# Altium schematic sheet Power.SchDoc
size A4
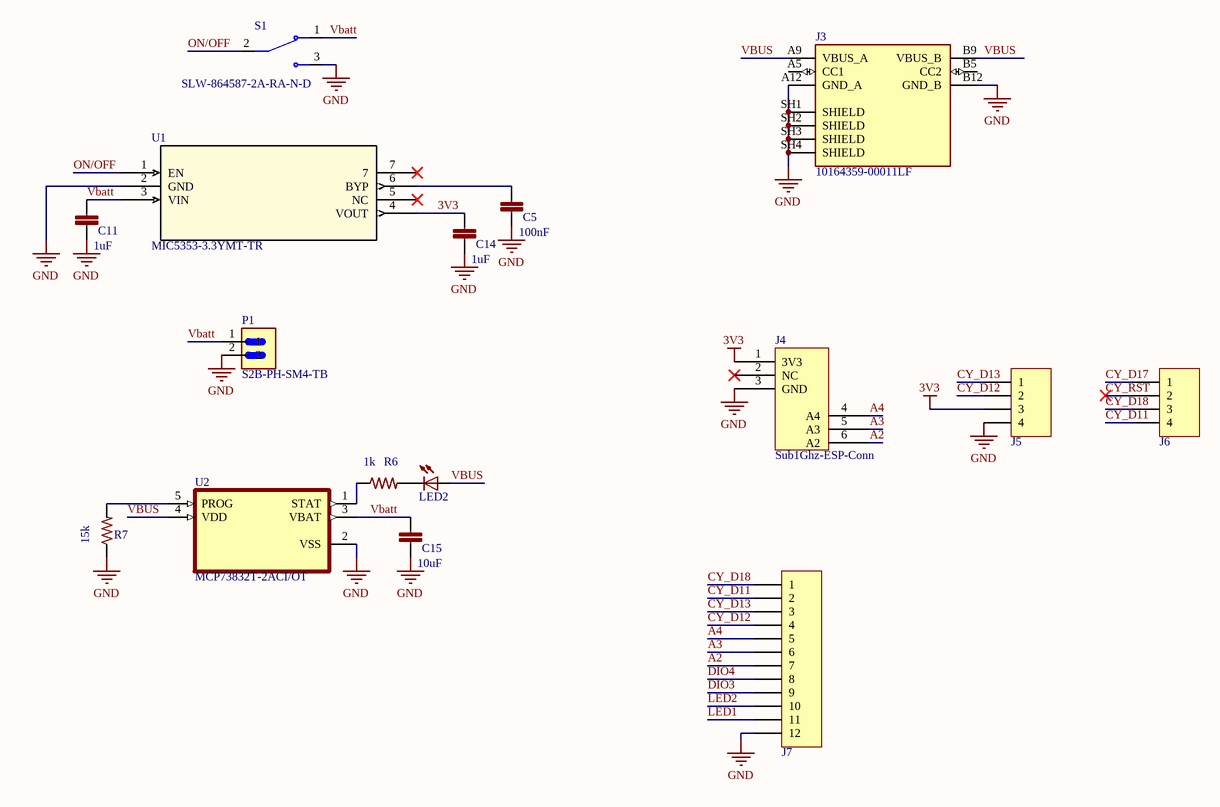
[diagram p0: Power.SchDoc]

## Parts
C5  100nF  [C0402 - rounded]
C11  1uF  [C0402 - rounded]
C14  1uF  [C0402 - rounded]
C15  10uF  [C0603 - rounded]
J3  10164359-00011LF  [AMPHENOL_10164359-00011LF]
J4  Sub1Ghz-ESP-Conn  [Sub1GHz-ESP-Conn]
J5  04p  [61300411121]  (value not drawn)
J6  04p  [61300411121]  (value not drawn)
J7  12p  [61301211821]  (value not drawn)
LED2  LEDCHIPLED_1206  [CHIPLED_1206]  (value not drawn)
P1  S2B-PH-SM4-TB  [JST_S2B-PH-SM4-TB]
R6  1k  [R0603 - rounded]
R7  15k  [R0603 - rounded]
S1  SLW-864587-2A-RA-N-D  [SW_SLW-864587-2A-RA-N-D]
U1  MIC5353-3.3YMT-TR  [MLF-6_MT_MCH-M]
U2  MCP73832T-2ACI/OT  [SOT95P270X145-5N]

## Nets
3V3: C14.1 J4.1(3V3) J5.3 U1.4(VOUT)
GND: C5.2 C11.2 C14.2 C15.2 J3.A12(GND_A) J3.B12(GND_B) J3.SH1(SHIELD) J3.SH2(SHIELD) J3.SH3(SHIELD) J3.SH4(SHIELD) J4.3(GND) J5.4 J7.12 P1.2 R7.1 S1.3 U1.2(GND) U2.2(VSS)
A2: J4.6(A2) J7.7
A3: J4.5(A3) J7.6
A4: J4.4(A4) J7.5
CY_D11: J6.4 J7.2
CY_D12: J5.2 J7.4
CY_D13: J5.1 J7.3
CY_D17: J6.1
CY_D18: J6.3 J7.1
CY_RST: J6.2
DIO3: J7.9
DIO4: J7.8
LED1: J7.11
LED2: J7.10
ON/OFF: S1.2 U1.1(EN)
Vbatt: C11.1 C15.1 P1.1 S1.1 U1.3(VIN) U2.3(VBAT)
VBUS: J3.A9(VBUS_A) J3.B9(VBUS_B) LED2.A U2.4(VDD)
NetC5_1: C5.1 U1.6(BYP)
NetLED2_C: LED2.C R6.2
NetR6_1: R6.1 U2.1(STAT)
NetR7_2: R7.2 U2.5(PROG)

Not connected (* = marked no-connect by the designer): J3 A5(CC1) B5(CC2); J4 2(NC)*; U1 5(NC)* 7*

## Library data of the parts
C5 C11 C14 C15 = C-EU-SMD: Generic Capacitor SMD
  C5: Value: 100nF
  C11 C14: Value: 1uF
  C15: Value: 10uF
J3 = 10164359-00011LF: USB Type C Receptacle SMT Single Row 6Pin; MF: Amphenol; MP: 1016435900011LF; SnapEDA_Link: https://www.snapeda.com/parts/1016435900011LF/Amphenol/view-part/?ref=snap; Package: None; Value: *; Check_prices: https://www.snapeda.com/parts/1016435900011LF/Amphenol/view-part/?ref=eda
J5 J6 = 61300411121: WR-PHD 2.54 mm THT Pin Header, 04p; Vendor: Wurth Elektronik; Part Number: 61300411121; Value: 04p
J7 = 61301211821: WR-PHD 2.54 mm Socket Header, 12p; Vendor: Wurth Elektronik; Part Number: 61301211821; Value: 12p
P1 = S2B-PH-SM4-TB: Connector Header Surface Mount, Right Angle 2 position 0.079 (2.00mm); MF: JST Sales; SnapEDA_Link: https://www.snapeda.com/parts/S2B-PH-SM4-TB/JST/view-part/?ref=snap; Package: None; Value: *; MP: S2B-PH-SM4-TB; Check_prices: https://www.snapeda.com/parts/S2B-PH-SM4-TB/JST/view-part/?ref=eda
R6 = R-US-SMD: Generic Resistor SMD; Value: 15k
R7 = R-US-SMD: Generic Resistor SMD; Value: 15k
S1 = SLW-864587-2A-RA-N-D: 8.6 x 4.5 x 8.7 mm, 2 mm Raised Slide Actuator, Right Angle, Through Hole, Slide Switch; MF: Same Sky; SnapEDA_Link: https://www.snapeda.com/parts/SLW-864587-2A-RA-N-D/Same+Sky/view-part/?ref=snap; Package: Package; Value: *; MP: SLW-864587-2A-RA-N-D; Check_prices: https://www.snapeda.com/parts/SLW-864587-2A-RA-N-D/Same+Sky/view-part/?ref=eda
U1 = MIC5353-3.3YMT-TR: Description; Manufacturer_Name: Microchip; Copyright: Copyright (C) 2025 Ultra Librarian. All rights reserved.; Manufacturer_Part_Number: MIC5353-3.3YMT-TR; RefDes: RefDes; Type: Type
U2 = MCP73832T-2ACI/OT: Linear Battery Charger Controller Li-Ion/Li-Pol 505mA 4.2V 5-Pin SOT-23 T/R; MF: Microchip Technology; SnapEDA_Link: https://www.snapeda.com/parts/MCP73832T-2ACI/OT/Microchip/view-part/?ref=snap; Package: SOT-23-5 Microchip; MP: MCP73832T-2ACI/OT; Check_prices: https://www.snapeda.com/parts/MCP73832T-2ACI/OT/Microchip/view-part/?ref=eda; Purchase-URL: https://pricing.snapeda.com/search/part/MCP73832T-2ACI/OT/?ref=eda; Price: None; Value: *; Availability: In Stock